# EasyEDA schematic 512KB Bootable ROM Cartridge 0.1A.json
TITLE: Turaco: 512KB Bootable ROM Cartridge; REV: 0.1A; Date: 2023-04-30; Drawn By: Kyle J Cardoza; Company: Studio 8502
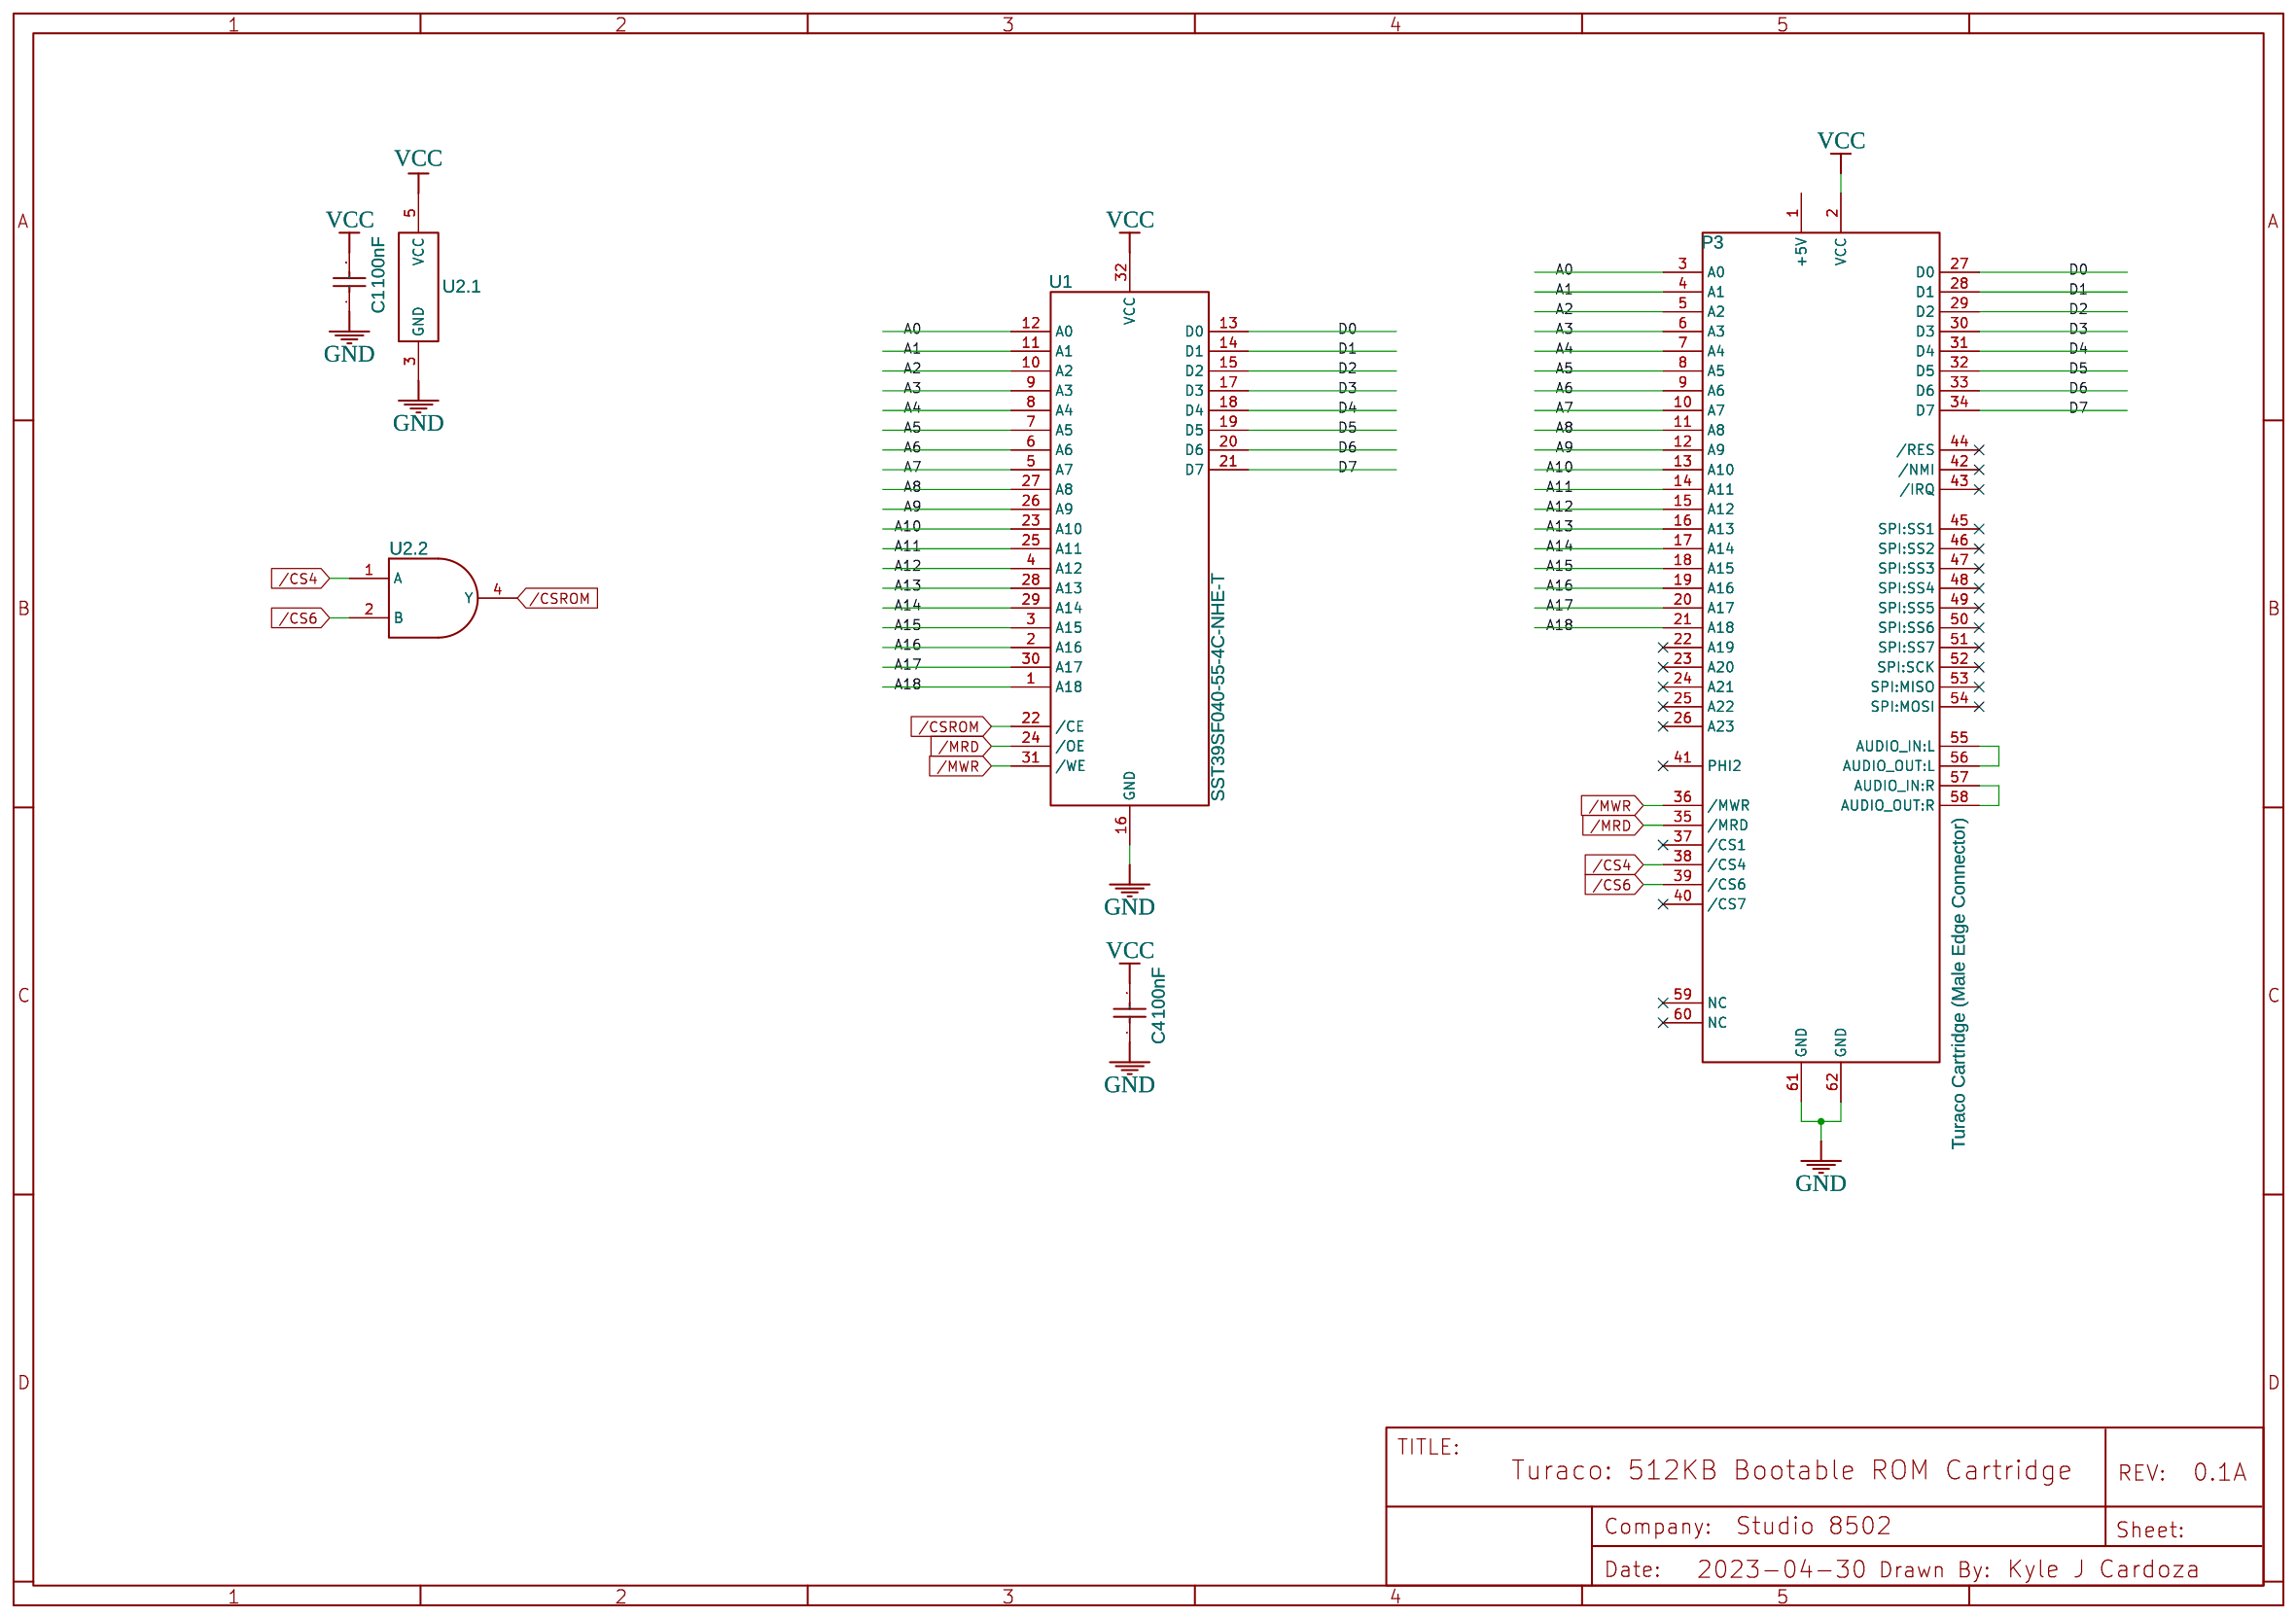
[diagram p0: schematic sheet]

## Parts
C1  100nF  [C0402]
C4  100nF  [C0402]
P3  Turaco Cartridge (Male Edge Connector)  [TURACO CARTRIDGE CONNECTOR (MALE - 62P - P2.54MM)]
U1  SST39SF040-55-4C-NHE-T  [PLCC32_PTH-SKT]
U2  SN74AHC1G08DCKR (AND GATE)  [SC-70-5_L2.1-W1.3-P0.65-LS2.1-BR]  (sections 1,2)

## Library data of the parts
C1 C4 = CL05B104KO5NNNC: Supplier: LCSC; Manufacturer: SAMSUNG(三星); Supplier Part: C1525; JLCPCB Part Class: Basic Part
P3 = Turaco Cartridge (Male Edge Connector): Contributor: kylecardoza1
U1 = SST39SF040-55-4C-NHE-T: Manufacturer: Microchip Technology; Supplier: Digi-Key; Supplier Part: SST39SF040-55-4C-NHE-TCT-ND; link: https://ww1.microchip.com/downloads/en/DeviceDoc/20005022C.pdf; Contributor: kylecardoza
U2 = SN74AHC1G08DCKR (AND GATE): Supplier: LCSC; Supplier Part: C122838; Manufacturer: TI(德州仪器); Manufacturer Part: SN74AHC1G08DCKR; Contributor: LCSC; JLCPCB Part Class: Extended Part; subpart_no: 1

## Nets
GND: C1.1 C4.1 P3.61(GND) P3.62(GND) U1.16(GND) U2.3(GND)
VCC: C1.2 C4.2 P3.2(VCC) U1.32(VCC) U2.5(VCC)
/CS4: P3.38(/CS4) U2.1(A)
/CS6: P3.39(/CS6) U2.2(B)
/CSROM: U1.22(/CE) U2.4(Y)
/MRD: P3.35(/MRD) U1.24(/OE)
/MWR: P3.36(/MWR) U1.31(/WE)
A0: P3.3(A0) U1.12(A0)
A1: P3.4(A1) U1.11(A1)
A2: P3.5(A2) U1.10(A2)
A3: P3.6(A3) U1.9(A3)
A4: P3.7(A4) U1.8(A4)
A5: P3.8(A5) U1.7(A5)
A6: P3.9(A6) U1.6(A6)
A7: P3.10(A7) U1.5(A7)
A8: P3.11(A8) U1.27(A8)
A9: P3.12(A9) U1.26(A9)
A10: P3.13(A10) U1.23(A10)
A11: P3.14(A11) U1.25(A11)
A12: P3.15(A12) U1.4(A12)
A13: P3.16(A13) U1.28(A13)
A14: P3.17(A14) U1.29(A14)
A15: P3.18(A15) U1.3(A15)
A16: P3.19(A16) U1.2(A16)
A17: P3.20(A17) U1.30(A17)
A18: P3.21(A18) U1.1(A18)
D0: P3.27(D0) U1.13(D0)
D1: P3.28(D1) U1.14(D1)
D2: P3.29(D2) U1.15(D2)
D3: P3.30(D3) U1.17(D3)
D4: P3.31(D4) U1.18(D4)
D5: P3.32(D5) U1.19(D5)
D6: P3.33(D6) U1.20(D6)
D7: P3.34(D7) U1.21(D7)
Net-(P3-55): P3.55(AUDIO_IN:L) P3.56(AUDIO_OUT:L)
Net-(P3-57): P3.57(AUDIO_IN:R) P3.58(AUDIO_OUT:R)

Not connected (* = marked no-connect by the designer): P3 1(+5V) 22(A19)* 23(A20)* 24(A21)* 25(A22)* 26(A23)* 37(/CS1)* 40(/CS7)* 41(PHI2)* 42(/NMI)* 43(/IRQ)* 44(/RES)* 45(SPI:SS1)* 46(SPI:SS2)* 47(SPI:SS3)* 48(SPI:SS4)* 49(SPI:SS5)* 50(SPI:SS6)* 51(SPI:SS7)* 52(SPI:SCK)* 53(SPI:MISO)* 54(SPI:MOSI)* 59(NC)* 60(NC)*
